# EAGLE design stylophone (EAGLE 6.6.0)
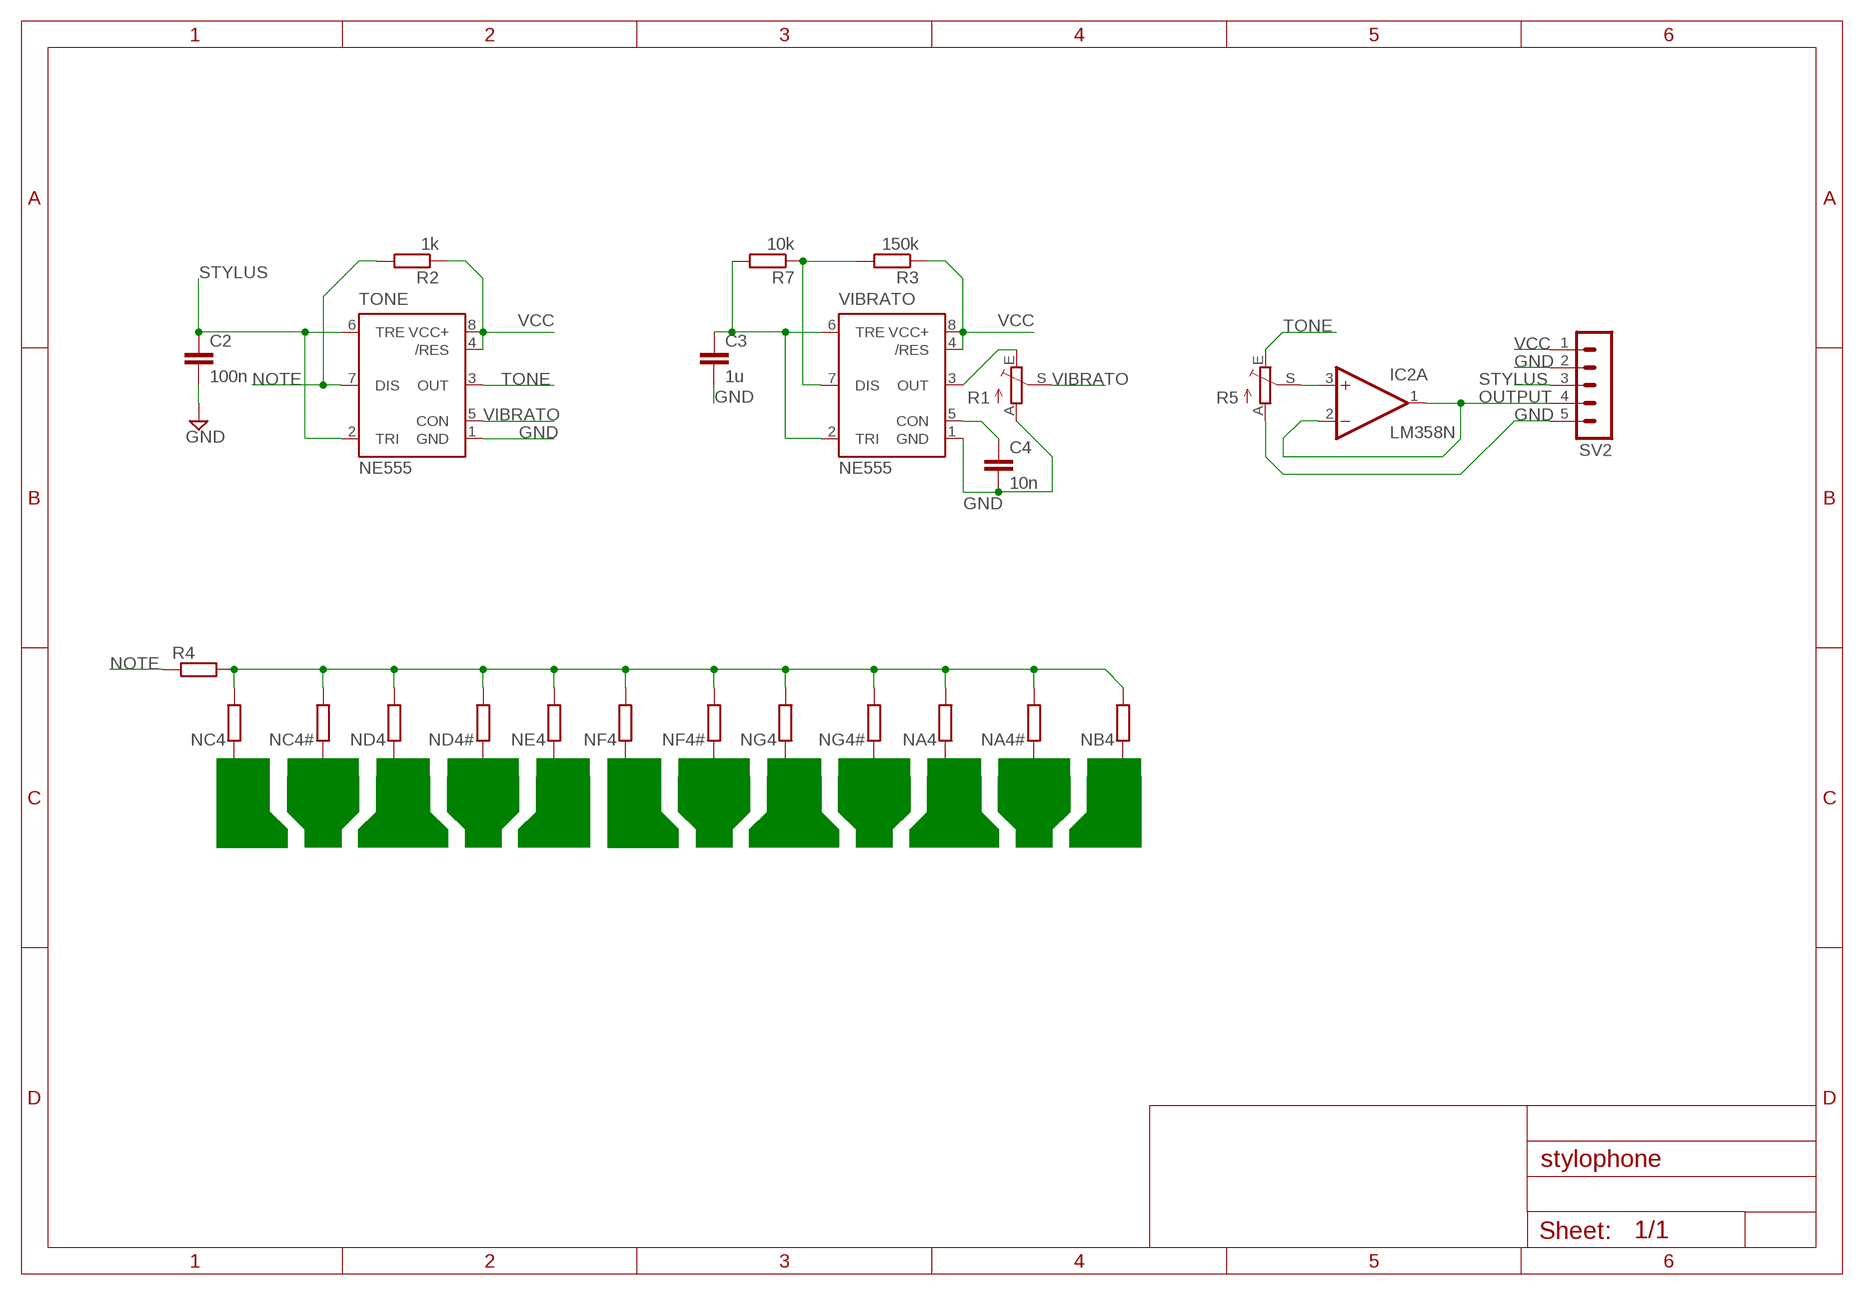
[diagram p0: schematic, sheet 1]

## Parts
C2  100n  C2.5/5  [C2.5-5]
C3  1u  C2.5/5  [C2.5-5]
C4  10n  C2.5/5  [C2.5-5]
IC2  LM358N  [DIL08]
NA4  R-EU_M1206  [M1206]
NA4#  R-EU_M1206  [M1206]
NB4  R-EU_M1206  [M1206]
NC4  R-EU_M1206  [M1206]
NC4#  R-EU_M1206  [M1206]
ND4  R-EU_M1206  [M1206]
ND4#  R-EU_M1206  [M1206]
NE4  R-EU_M1206  [M1206]
NF4  R-EU_M1206  [M1206]
NF4#  R-EU_M1206  [M1206]
NG4  R-EU_M1206  [M1206]
NG4#  R-EU_M1206  [M1206]
R1  TRIM_EU-CA9V  [CA9V]
R2  1k  R-EU_M1206  [M1206]
R3  150k  R-EU_M1206  [M1206]
R4  R-EU_0204/7  [0204/7]
R5  TRIM_EU-CA9V  [CA9V]
R7  10k  R-EU_M1206  [M1206]
SV2  MA05-1  [MA05-1]
TONE  NE555  [DIL-08]
VIBRATO  NE555  [DIL-08]

## Nets
GND: C2.2 C3.2 C4.2 R1.A R5.A SV2.2 SV2.5 TONE.1(GND) VIBRATO.1(GND)
KEYBOARD: NA4#.2 NA4.2 NB4.2 NC4#.2 NC4.2 ND4#.2 ND4.2 NE4.2 NF4#.2 NF4.2 NG4#.2 NG4.2 R4.2
N$1: C4.1 VIBRATO.5(CON)
N$2: R1.E VIBRATO.3(OUT)
N$3: R3.2 R7.1 VIBRATO.7(DIS)
N$5: IC2.3(A:+IN) R5.S
NOTE: R2.2 R4.1 TONE.7(DIS)
NOTSTYLUS: C3.1 R7.2 VIBRATO.2(TRI) VIBRATO.6(TRE)
OUTPUT: IC2.1(A:OUT) IC2.2(A:-IN) SV2.4
STYLUS: C2.1 SV2.3 TONE.2(TRI) TONE.6(TRE)
TONE: R5.E TONE.3(OUT)
VCC: R2.1 R3.1 SV2.1 TONE.4(/RES) TONE.8(VCC+) VIBRATO.4(/RES) VIBRATO.8(VCC+)
VIBRATO: R1.S TONE.5(CON)
Unconnected: IC2.5(B:+IN) IC2.6(B:-IN) IC2.7(B:OUT) NA4#.1 NA4.1 NB4.1 NC4#.1 NC4.1 ND4#.1 ND4.1 NE4.1 NF4#.1 NF4.1 NG4#.1 NG4.1

## Power pins joined to a net without a drawn wire
V+: IC2.8(P:V+)
V-: IC2.4(P:V-)

## Library data of the parts
C2-C4 = capacitor-wima:C: CAPACITOR naming: grid - package width
IC2 = linear:LM358: OP AMP also LM158; LM258; LM2904 Source: http://cache.national.com/ds/LM/LM158.pdf
NA4 NA4# NB4 NC4 NC4# ND4 ND4# NE4 NF4 NF4# NG4 NG4# R2 R3 R7 = resistor:R-EU_: RESISTOR, European symbol
R1 R5 = pot:TRIM_EU-: POTENTIOMETER
R4 = rcl:R-EU_: RESISTOR, European symbol
SV2 = con-lstb:MA05-1: PIN HEADER; OC_FARNELL: unknown; OC_NEWARK: unknown
TONE VIBRATO = st-microelectronics:NE555: General purpose bipolar Timer; MF: Arrow Electronics; MPN: NE555N; OC_FARNELL: 1467742; OC_NEWARK: 89K1486

## Board
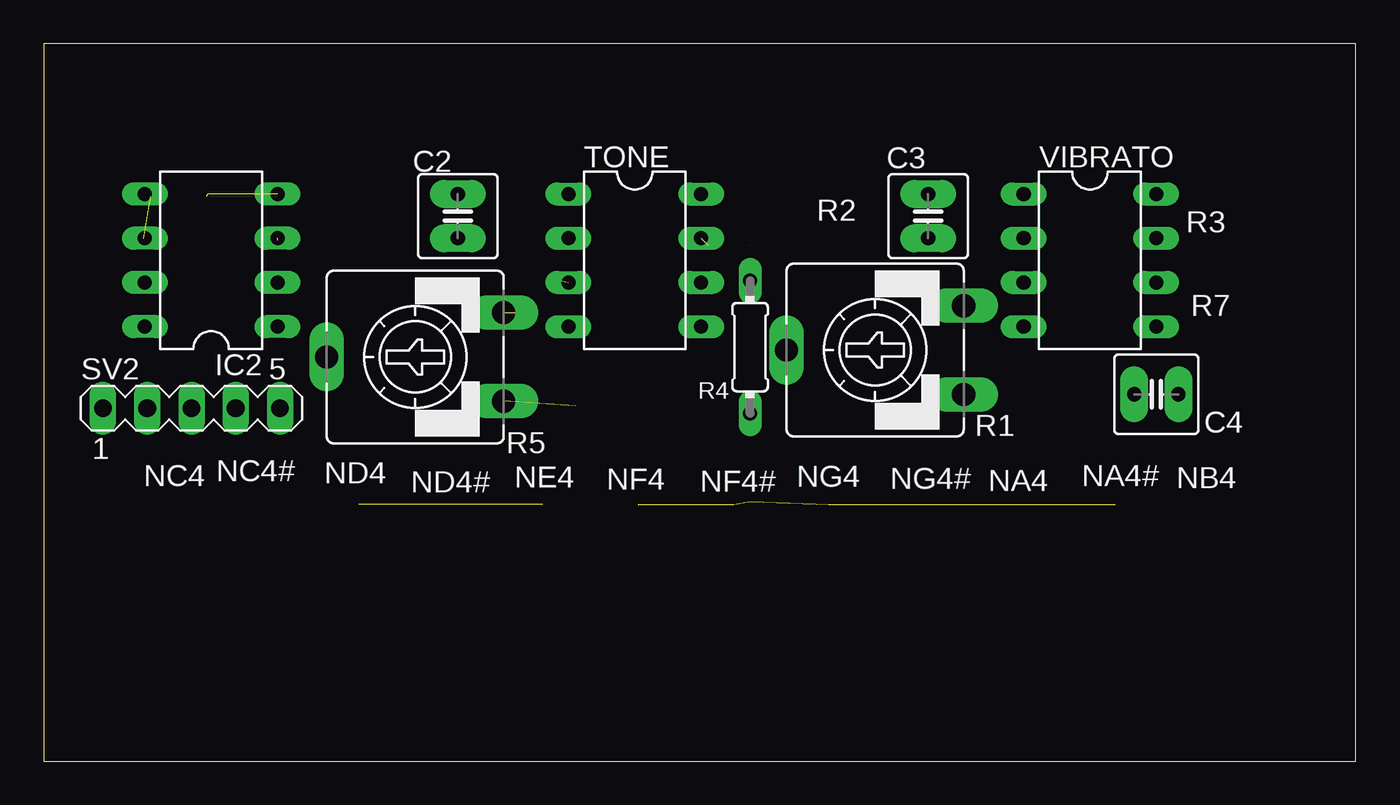
[diagram p1: board, top side]
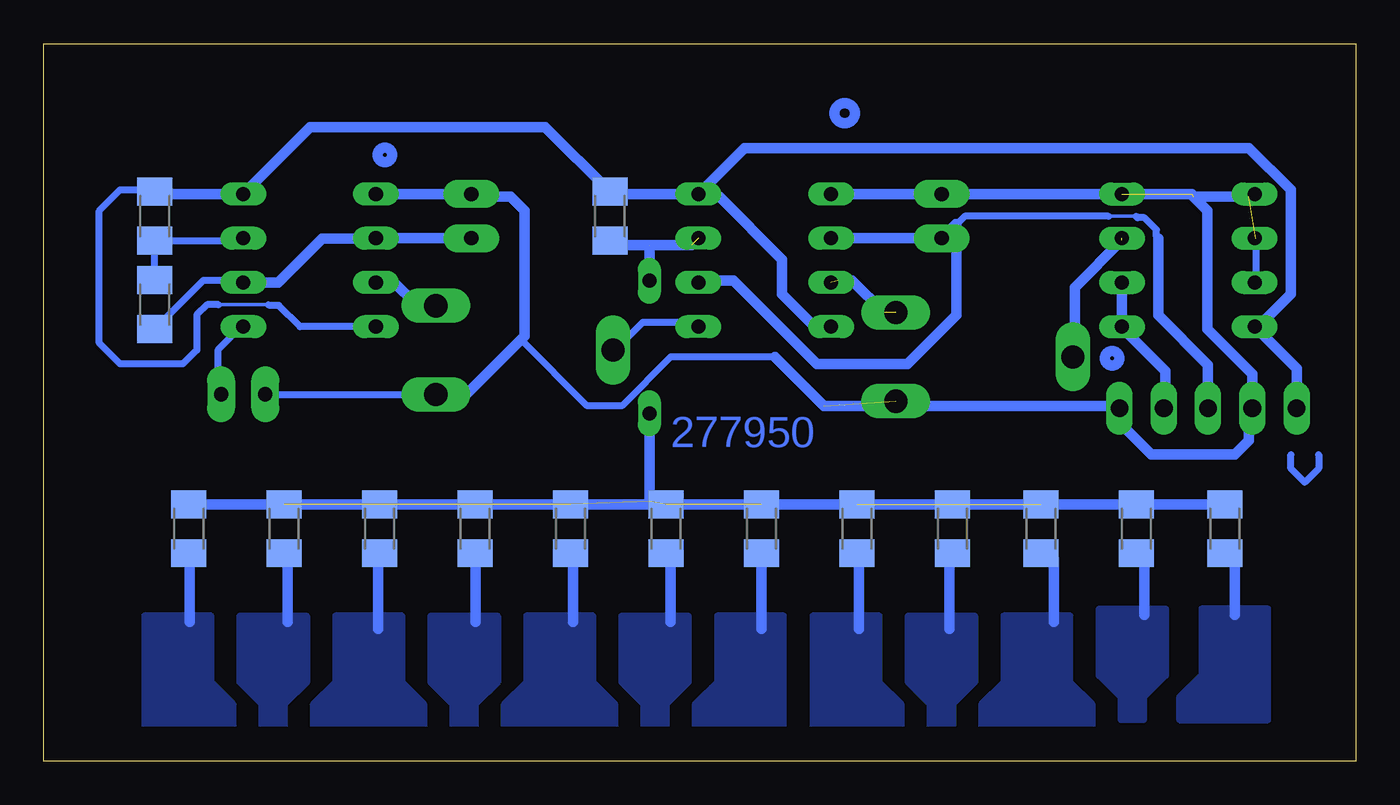
[diagram p2: board, bottom side, seen from below]

Size 75.34 x 41.2 mm. Coordinates in mm from the lower left corner, seen from the top.
Outline: 0,0 75.34,0 75.34,41.2 0,41.2 0,0
Copper layers (1*16): Top 0.035mm / dielectric 1.5mm / Bottom 0.035mm
Design rules "OpenLab": minimum track width 0.4mm, minimum drill 0.6mm, track to track 0.5mm, track to pad 0.5mm, pad to pad 0.5mm, via to via 0.5mm, smd to smd 0.1mm, copper to edge 2mm, drill to drill 0.2mm, minimum pad ring 10mil, minimum via ring 8mil, stop-mask expansion 4mil, vias tented up to drill 0mil, thermal gap 10mil

### Footprints (pad centres in the part's own frame; a part is rotated, then mirrored left to right if it is on the bottom)
C2.5-5 = drill 0.813 pad 1.6 long: 1 -1.27,0; 2 1.27,0
DIL08 = drill 0.813 pad 1.27 long: 1 -3.81,-3.81; 2 -1.27,-3.81; 3 1.27,-3.81; 4 3.81,-3.81; 5 3.81,3.81; 6 1.27,3.81; 7 -1.27,3.81; 8 -3.81,3.81
M1206 = smd 1.6 x 2: 1 -1.4,0; 2 1.4,0
CA9V = drill 1.321 long: A -2.54,-5.08; E 2.54,-5.08; S 0,5.08
0204/7 = drill 0.813 long: 1 -3.81,0; 2 3.81,0
MA05-1 = drill 1.016 long: 1 -5.08,0; 2 -2.54,0; 3 0,0; 4 2.54,0; 5 5.08,0
DIL-08 = drill 0.813 long: 1 -3.81,-3.81; 2 -1.27,-3.81; 3 1.27,-3.81; 4 3.81,-3.81; 5 3.81,3.81; 6 1.27,3.81; 7 -1.27,3.81; 8 -3.81,3.81

### Placement (x,y rotation side)
C2  23.78,31.29 90 top
C3  50.78,31.29 90 top
C4  63.88,21.06 180 top
IC2  9.62,28.75 90 top
NA4  56.04,13.34 90 bottom
NA4#  61.52,13.34 90 bottom
NB4  67,13.34 90 bottom
NC4  7.52,13.34 90 bottom
NC4#  12.6,13.34 90 bottom
ND4  18.08,13.34 90 bottom
ND4#  23.16,13.34 90 bottom
NE4  28.64,13.34 90 bottom
NF4  34.12,13.34 90 bottom
NF4#  39.6,13.34 90 bottom
NG4  45.08,13.34 90 bottom
NG4#  50.56,13.34 90 bottom
R1  47.74,23.6 90 top
R2  42.83,31.29 270 bottom
R3  68.96,31.29 270 bottom
R4  40.56,23.77 270 top
R5  21.34,23.2 90 top
R7  68.96,26.21 270 bottom
SV2  8.49,20.26 0 top
TONE  33.94,28.75 270 top
VIBRATO  60.07,28.75 270 top

### Tracks (layer width: path | path; a pad name or v marks a point on that pad's centre or on a via)
GND  (4 unrouted)
  Bottom 0.406: C4.2 R1.A 51.08,21.06 | 50.62,32.4 C3.2 | 33.34,23.2 39.34,23.2 42.14,20.4 44.14,20.4 47.94,24.2 | 5.74,30 5.74,27.2
  Bottom 0.61: 51.08,21.06 47.94,24.2 47.74,24.4 47.74,31.6 48.54,32.4 50.62,32.4 | VIBRATO.1 C3.2 | 33.34,23.2 30.54,20.4 13.71,20.4 SV2.5 13.57,19.43 11.74,17.6 6.94,17.6 6.14,18.4 6.14,20.07 SV2.2 5.95,22.21 8.54,24.8 8.54,31.6 9.34,32.4 6.14,32.4 | TONE.1 C2.2 9.43,32.56
KEYBOARD  (8 unrouted)
  Bottom 0.61: NC4.2 NC4#.2 ND4.2 NF4#.2 NB4.2 | R4.2 40.56,14.9
N$1
  Bottom 0.406: VIBRATO.5 64,24.94 65.34,23.6 65.34,21.25 C4.1
N$2
  Bottom 0.61: R1.E 53.88,26.14 55.34,27.6 56.14,27.6 VIBRATO.3
N$3
  Bottom 0.406: R7.1 R3.2 64.01,29.89 VIBRATO.7
N$4
  Bottom 0.406: 2.14,17.6 2.14,16.8 2.94,16 3.74,16.8 3.74,17.6
N$5  (1 unrouted)
  Bottom 0.61: 13.43,29.91 16.14,27.2 16.14,23.32 R5.S
NA4
  Bottom 0.61: 56.14,11.6 56.14,7.6
  pour Bottom: 53.5,1.98 53.5,3.25 54.77,4.52 54.77,8.33 58.58,8.33 58.58,4.52 59.85,3.25 59.85,1.98
NA4#
  Bottom 0.61: 61.34,11.6 61.34,8
  pour Bottom: 62.79,1.98 62.79,3.25 64.06,4.52 64.06,8.33 60.25,8.33 60.25,4.52 61.52,3.25 61.52,1.98
NB4
  Bottom 0.61: 66.94,11.6 66.94,8
  pour Bottom: 69.54,8.33 69.54,1.98 64.46,1.98 64.46,3.25 65.73,4.52 65.73,8.33
NC4
  Bottom 0.61: 6.94,11.6 6.94,8.4
  pour Bottom: 5.05,8.73 8.86,8.73 8.86,4.92 10.13,3.65 10.13,2.38 5.05,2.38
NC4#
  Bottom 0.61: 12.14,11.6 12.14,8.4
  pour Bottom: 13.47,2.38 13.47,3.65 14.74,4.92 14.74,8.73 10.93,8.73 10.93,4.92 12.2,3.65 12.2,2.38
ND4
  Bottom 0.61: 17.34,11.6 17.34,8
  pour Bottom: 15.14,1.98 15.14,3.25 16.41,4.52 16.41,8.33 20.22,8.33 20.22,4.52 21.49,3.25 21.49,1.98
ND4#
  Bottom 0.61: 23.34,11.6 23.34,7.6
  pour Bottom: 24.43,1.98 24.43,3.25 25.7,4.52 25.7,8.33 21.89,8.33 21.89,4.52 23.16,3.25 23.16,1.98
NE4
  Bottom 0.61: 28.54,11.6 28.54,7.6
  pour Bottom: 31.18,8.33 31.18,1.98 26.1,1.98 26.1,3.25 27.37,4.52 27.37,8.33
NF4
  Bottom 0.61: 34.14,11.6 34.14,7.6
  pour Bottom: 32.85,8.33 36.66,8.33 36.66,4.52 37.93,3.25 37.93,1.98 32.85,1.98
NF4#
  Bottom 0.61: 39.34,11.6 39.34,8
  pour Bottom: 40.87,1.98 40.87,3.25 42.14,4.52 42.14,8.33 38.33,8.33 38.33,4.52 39.6,3.25 39.6,1.98
NG4
  Bottom 0.61: 44.94,11.6 44.94,8
  pour Bottom: 42.54,1.98 42.54,3.25 43.81,4.52 43.81,8.33 47.62,8.33 47.62,4.52 48.89,3.25 48.89,1.98
NG4#
  Bottom 0.61: 50.54,12 50.54,8
  pour Bottom: 51.83,1.98 51.83,3.25 53.1,4.52 53.1,8.33 49.29,8.33 49.29,4.52 50.56,3.25 50.56,1.98
NOTE  (2 unrouted)
  Bottom 0.406: 42.56,29.62 R2.2 | 38.15,29.62 38.14,29.62 38.14,30.4
  Bottom 0.61: 42.56,29.62 40.52,29.62 | 38.15,29.62 40.52,29.62 | 40.52,29.62 40.54,29.6 | R4.1 40.56,29.6
NOTSTYLUS
  Bottom 0.406: VIBRATO.6 64,27.6 66.17,27.6 R7.2
  Bottom 0.61: VIBRATO.6 61.86,27.48 59.34,30 56.28,30 VIBRATO.2 C3.1
OUTPUT
  Bottom 0.61: IC2.2 IC2.1 13.43,24.89 10.94,22.4 10.94,20.35 SV2.4
STYLUS
  Bottom 0.203: 12.62,31.29 14.21,31.29
  Bottom 0.406: 11.34,30 11.34,30.11 11.45,30.11 11.45,30.51 12.14,31.2 12.54,31.2 12.62,31.29 | 14.21,31.29 22.45,31.29 22.94,30.8
  Bottom 0.61: TONE.2 C2.1 22.97,30.83 22.94,30.8 22.94,25.6 25.74,22.8 30.94,22.8 35.74,27.6 37.63,27.6 TONE.6 | SV2.3 8.49,22.75 11.34,25.6 11.34,30
TONE  (2 unrouted)
  Bottom 0.61: 27.08,25.74 28.94,27.6 29.74,27.6
VCC
  Bottom 0.203: 65.3,26.21 62.42,26.21
  Bottom 0.406: R3.1 69.07,32.8 70.94,32.8 72.14,31.6 72.14,24 70.94,22.8 67.34,22.8 66.54,23.6 66.54,25.63 65.96,26.21 65.3,26.21 | VIBRATO.4 60.61,24.94 61.84,26.16 62.38,26.16 62.42,26.21
  Bottom 0.61: TONE.8 42.83,32.56 R2.1 46.54,36.4 60.04,36.4 VIBRATO.8 68.83,32.56 R3.1 | SV2.1 3.41,22.54 IC2.8 5.6,24.94 3.74,26.8 3.74,32.8 6.14,35.2 35.11,35.2 TONE.8 | TONE.4 31.08,24.94 32.94,26.8 32.94,28.8 36.54,32.4 37.59,32.4 TONE.8
VIBRATO
  Bottom 0.406: R1.S 42.54,23.6 40.94,25.2 38.01,25.2 TONE.5
(copper drawn outside any net)
  shapes: Bottom circle x3

### Text on the board
Bottom: 277950